# EAGLE schematic mp28164-buck-boost-flashlight-driver-tester-mk-1.0.2.opamp.only (EAGLE 9.2.2)
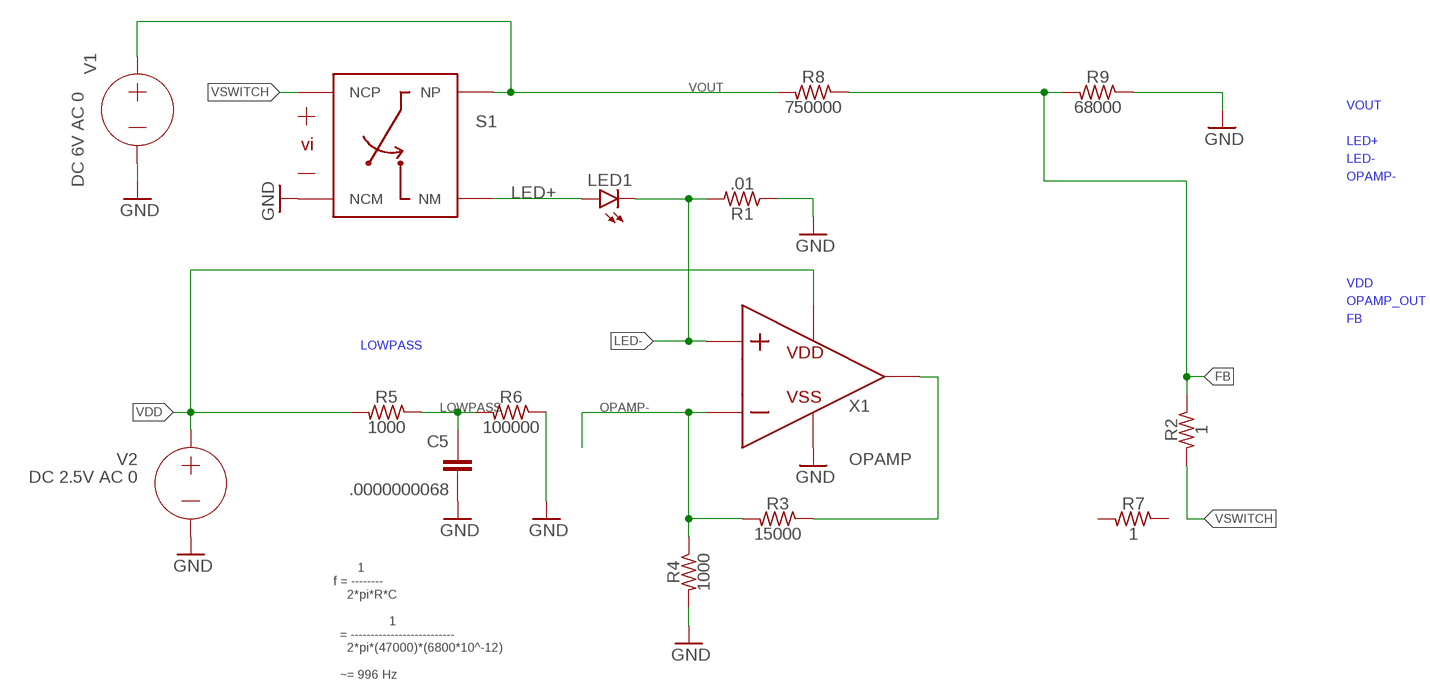
[diagram p0: schematic, sheet 1]

## Parts
C5  .0000000068  CAPACITOR-CERAMICC0402  [C0402]
LED1  LED3MM  [LED3MM]
R1  .01  RESISTORR0805-TIGHTER  [R0805-TIGHTER]
R2  1  RESISTORR0402  [R0402]
R3  15000  RESISTORR0402  [R0402]
R4  1000  RESISTORR0402  [R0402]
R5  1000  RESISTORR0402  [R0402]
R6  100000  RESISTORR0402  [R0402]
R7  1  RESISTORR0402  [R0402]
R8  750000  RESISTORR0402  [R0402]
R9  68000  RESISTORR0402  [R0402]
S1  V_SWITCH  (no package)
V1  DC 6V AC 0  VOLTAGE  (no package)
V2  DC 2.5V AC 0  VOLTAGE  (no package)
X1  OPAMP  (no package)

## Nets
FB: R2.1 R8.1 R9.2
GND: C5.2 R1.1 R4.2 R6.1 R9.1 S1.NCM V1.- V2.- X1.VSS
LED+: LED1.A S1.NM
LED-: LED1.K(C) R1.2 X1.P
LOWPASS: C5.1 R5.1 R6.2
OPAMP-: R3.2 R4.1 X1.N
OPAMP_OUT: R3.1 X1.VOUT
VDD: R5.2 V2.+ X1.VDD
VOUT: R8.2 S1.NP V1.+
VSWITCH: R2.2 S1.NCP
Unconnected: R7.1 R7.2

## Notes on the sheet
- 1
  f = --------
      2*pi*R*C
  
                  1
    = --------------------------
      2*pi*(47000)*(6800*10^-12)
  
    ~= 996 Hz

## Library data of the parts
C5 = a_parts:CAPACITOR-CERAMIC: CAPACITOR, European symbol; SPICEPREFIX: C
LED1 = a_parts:LED: LEDs Standard schematic elements and footprints for 5mm, 3mm, 1206, and 0603 sized LEDs. 5mm - Spark Fun Electronics SKU : COM-00529 (and others); SPICEMODEL: DMOD; SPICEPREFIX: D
R1-R9 = a_parts:RESISTOR: RESISTOR, American symbol; SPICEPREFIX: R
S1 = ngspice-simulation:V_SWITCH: Voltage controlled Switch; SPICEEXTRA: OFF; SPICEMODEL: VSMOD; SPICEPREFIX: S
V1 V2 = ngspice-simulation:VOLTAGE: Independent Voltage Source, either DC, AC, PULSE, SINE, PWL, EXP, or SFFM; VALUE: 0V
X1 = ngspice-simulation:OPAMP: Operational amplifier with power pins; SPICEMODEL: OPAMP; SPICEPREFIX: X